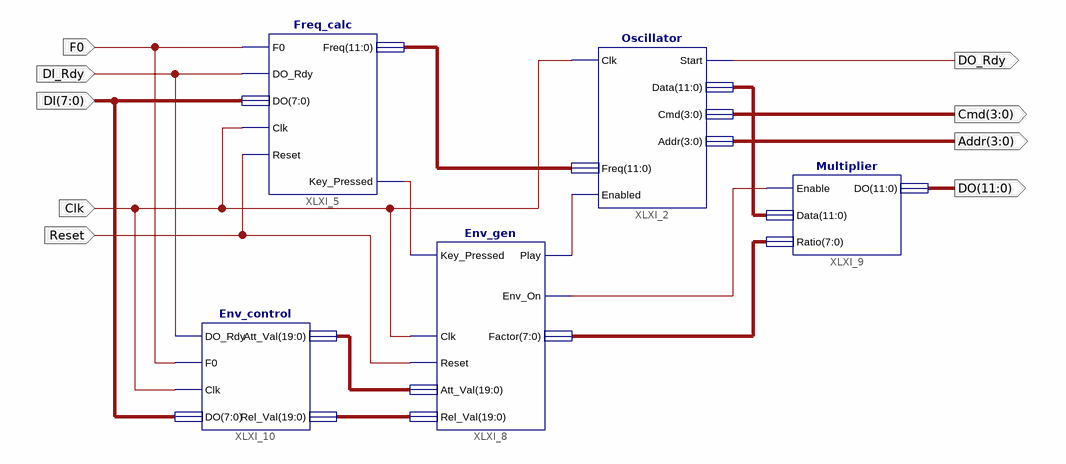
[diagram p0: schematic sheet 1]
// Xilinx ISE schematic Module_Generation.sch (spartan3e) as structural Verilog: 5 symbols, 9 ports
module Module_Generation (
  input  [7:0] DI,
  input  DI_Rdy,
  input  F0,
  input  Clk,
  input  Reset,
  output DO_Rdy,
  output [3:0] Cmd,
  output [3:0] Addr,
  output [11:0] DO
);

  wire XLXN_7, XLXN_16, XLXN_109;
  wire [7:0] XLXN_34;
  wire [11:0] XLXN_1, XLXN_110;
  wire [19:0] XLXN_121, XLXN_122;

  Freq_calc XLXI_5 (.F0(F0), .DO_Rdy(DI_Rdy), .Clk(Clk), .Reset(Reset), .DO(DI), .Key_Pressed(XLXN_16), .Freq(XLXN_1));
  Oscillator XLXI_2 (
    .Enabled(XLXN_7), .Clk(Clk), .Freq(XLXN_1), .Start(DO_Rdy), .Data(XLXN_110), .Cmd(Cmd), .Addr(Addr));
  Env_gen XLXI_8 (
    .Key_Pressed(XLXN_16), .Reset(Reset), .Clk(Clk), .Att_Val(XLXN_121), .Rel_Val(XLXN_122), .Play(XLXN_7),
    .Env_On(XLXN_109), .Factor(XLXN_34));
  Multiplier XLXI_9 (.Enable(XLXN_109), .Data(XLXN_110), .Ratio(XLXN_34), .DO(DO));
  Env_control XLXI_10 (.DO_Rdy(DI_Rdy), .F0(F0), .Clk(Clk), .DO(DI), .Att_Val(XLXN_121), .Rel_Val(XLXN_122));
endmodule
